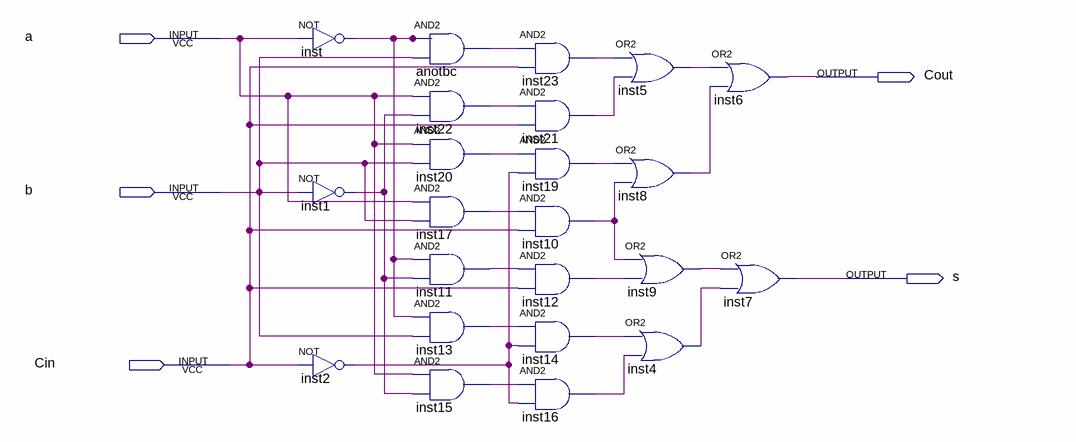
[diagram p0: schematic sheet]
// Quartus schematic lab3.bdf as structural Verilog: 23 symbols, 5 pins
module lab3 (
  input  a,
  input  b,
  input  Cin,
  output Cout,
  output s
);

  wire anotbc_out, inst1_out, inst2_out, inst4_out, inst5_out, inst8_out, inst9_out, inst10_out, inst11_out,
       inst12_out, inst13_out, inst14_out, inst15_out, inst16_out, inst17_out, inst19_out, inst20_out,
       inst21_out, inst22_out, inst23_out, inst_out;

  not inst (inst_out, a);
  not inst1 (inst1_out, b);
  not inst2 (inst2_out, Cin);
  and anotbc (anotbc_out, inst_out, b);
  and inst22 (inst22_out, a, inst1_out);
  and inst20 (inst20_out, a, b);
  and inst17 (inst17_out, a, b);
  and inst11 (inst11_out, inst_out, inst1_out);
  and inst13 (inst13_out, inst_out, b);
  and inst15 (inst15_out, a, inst1_out);
  and inst23 (inst23_out, anotbc_out, Cin);
  and inst21 (inst21_out, inst22_out, Cin);
  and inst19 (inst19_out, inst20_out, inst2_out);
  and inst10 (inst10_out, inst17_out, Cin);
  and inst12 (inst12_out, inst11_out, Cin);
  and inst14 (inst14_out, inst13_out, inst2_out);
  and inst16 (inst16_out, inst15_out, inst2_out);
  or inst5 (inst5_out, inst23_out, inst21_out);
  or inst8 (inst8_out, inst19_out, inst10_out);
  or inst9 (inst9_out, inst10_out, inst12_out);
  or inst4 (inst4_out, inst14_out, inst16_out);
  or inst6 (Cout, inst5_out, inst8_out);
  or inst7 (s, inst9_out, inst4_out);
endmodule
